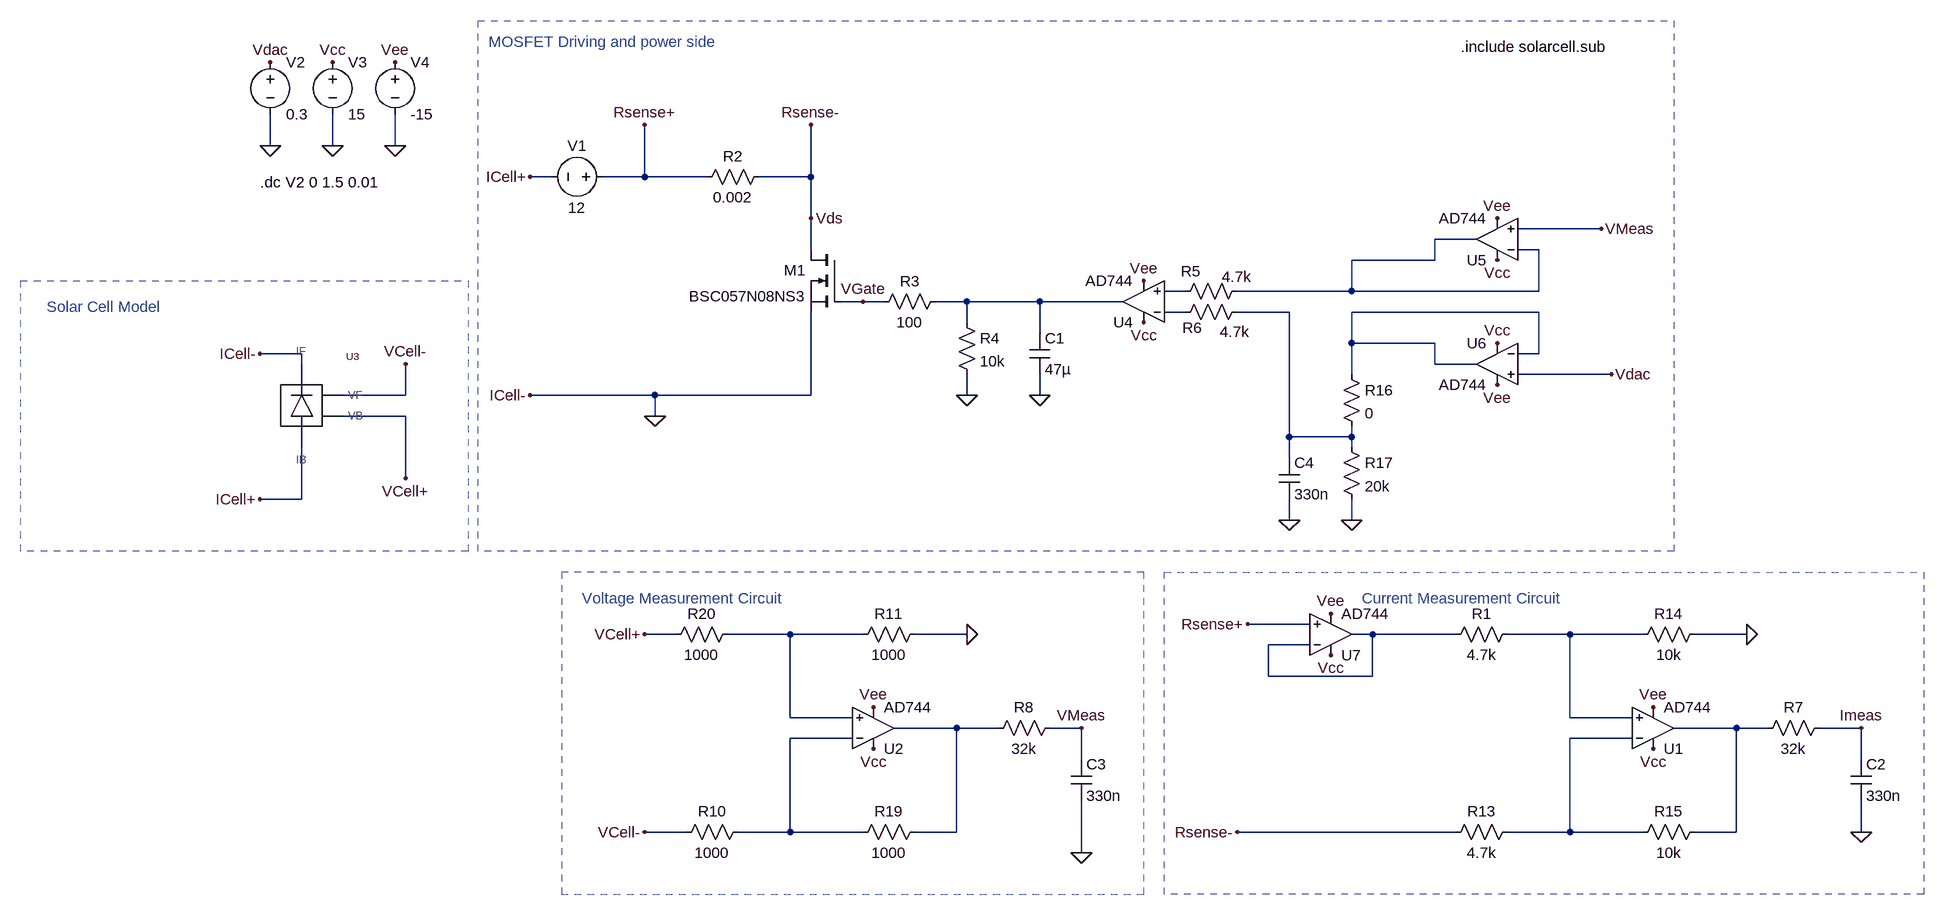
[diagram p0: schematic IVTesterFullCircuit - FVMI.asc]
IVTesterFullCircuit - FVMI.asc, the LTspice schematic file:
Version 4
SHEET 1 2216 2084
WIRE -352 528 -352 480
WIRE -256 528 -256 480
WIRE -160 528 -160 480
WIRE 80 576 48 576
WIRE 224 576 224 496
WIRE 224 576 160 576
WIRE 320 576 224 576
WIRE 480 576 480 496
WIRE 480 576 400 576
WIRE 480 640 480 576
WIRE 1696 656 1568 656
WIRE 1504 672 1440 672
WIRE 480 688 480 640
WIRE 1600 688 1568 688
WIRE 1440 704 1440 672
WIRE 1440 704 1312 704
WIRE 1056 752 1024 752
WIRE 1312 752 1312 704
WIRE 1312 752 1136 752
WIRE 1600 752 1600 688
WIRE 1600 752 1312 752
WIRE 560 768 528 768
WIRE 592 768 560 768
WIRE 720 768 672 768
WIRE 832 768 720 768
WIRE 960 768 832 768
WIRE 1056 784 1024 784
WIRE 1216 784 1136 784
WIRE 1600 784 1312 784
WIRE 720 800 720 768
WIRE 832 816 832 768
WIRE 1312 832 1312 784
WIRE 1440 832 1312 832
WIRE -304 848 -368 848
WIRE 1600 848 1600 784
WIRE 1600 848 1568 848
WIRE -304 864 -304 848
WIRE 1440 864 1440 832
WIRE 1504 864 1440 864
WIRE 1312 880 1312 832
WIRE 1712 880 1568 880
WIRE -144 912 -144 864
WIRE -144 912 -240 912
WIRE 240 912 48 912
WIRE 480 912 480 784
WIRE 480 912 240 912
WIRE 720 912 720 880
WIRE 832 912 832 880
WIRE -144 944 -240 944
WIRE 240 944 240 912
WIRE 1216 976 1216 784
WIRE 1312 976 1312 960
WIRE 1312 976 1216 976
WIRE 1312 992 1312 976
WIRE 1216 1008 1216 976
WIRE -144 1040 -144 944
WIRE -304 1072 -304 992
WIRE -304 1072 -368 1072
WIRE 1216 1104 1216 1072
WIRE 1312 1104 1312 1072
WIRE 1248 1264 1152 1264
WIRE 272 1280 224 1280
WIRE 448 1280 352 1280
WIRE 560 1280 448 1280
WIRE 720 1280 640 1280
WIRE 1344 1280 1312 1280
WIRE 1472 1280 1344 1280
WIRE 1648 1280 1552 1280
WIRE 1760 1280 1648 1280
WIRE 1920 1280 1840 1280
WIRE 1248 1296 1184 1296
WIRE 1184 1344 1184 1296
WIRE 1344 1344 1344 1280
WIRE 1344 1344 1184 1344
WIRE 448 1408 448 1280
WIRE 544 1408 448 1408
WIRE 1648 1408 1648 1280
WIRE 1744 1408 1648 1408
WIRE 704 1424 608 1424
WIRE 768 1424 704 1424
WIRE 896 1424 848 1424
WIRE 1904 1424 1808 1424
WIRE 1952 1424 1904 1424
WIRE 2096 1424 2032 1424
WIRE 544 1440 448 1440
WIRE 1744 1440 1648 1440
WIRE 896 1472 896 1424
WIRE 2096 1472 2096 1424
WIRE 288 1584 224 1584
WIRE 448 1584 448 1440
WIRE 448 1584 368 1584
WIRE 560 1584 448 1584
WIRE 704 1584 704 1424
WIRE 704 1584 640 1584
WIRE 1472 1584 1136 1584
WIRE 1648 1584 1648 1440
WIRE 1648 1584 1552 1584
WIRE 1760 1584 1648 1584
WIRE 1904 1584 1904 1424
WIRE 1904 1584 1840 1584
WIRE 2096 1584 2096 1536
WIRE 896 1616 896 1536
FLAG 720 912 0
FLAG 832 912 0
FLAG 48 576 ICell+
FLAG -352 400 Vdac
FLAG -352 528 0
FLAG -256 528 0
FLAG -160 528 0
FLAG -256 400 Vcc
FLAG -160 400 Vee
FLAG 992 800 Vcc
FLAG 1536 704 Vcc
FLAG 1536 832 Vcc
FLAG 992 736 Vee
FLAG 1536 640 Vee
FLAG 1536 896 Vee
FLAG 1920 1280 0
FLAG 2096 1584 0
FLAG 224 496 Rsense+
FLAG 480 496 Rsense-
FLAG 1136 1584 Rsense-
FLAG 1776 1456 Vcc
FLAG 1776 1392 Vee
FLAG 1312 1104 0
FLAG 1216 1104 0
FLAG 240 944 0
FLAG 1712 880 Vdac
FLAG 1696 656 VMeas
FLAG -144 864 VCell-
FLAG -144 1040 VCell+
FLAG 48 912 ICell-
FLAG 1152 1264 Rsense+
FLAG 1280 1312 Vcc
FLAG 1280 1248 Vee
FLAG 480 640 Vds
FLAG 2096 1424 Imeas
FLAG 720 1280 0
FLAG 896 1616 0
FLAG 576 1456 Vcc
FLAG 576 1392 Vee
FLAG 224 1280 VCell+
FLAG 896 1424 VMeas
FLAG 560 768 VGate
FLAG 224 1584 VCell-
FLAG -368 1072 ICell+
FLAG -368 848 ICell-
SYMBOL res 416 560 R90
WINDOW 0 0 56 VBottom 2
WINDOW 3 32 56 VTop 2
SYMATTR InstName R2
SYMATTR Value 0.002
SYMBOL voltage 176 576 R90
WINDOW 0 -32 56 VBottom 2
WINDOW 3 32 56 VTop 2
WINDOW 123 0 0 Left 0
WINDOW 39 0 0 Left 0
SYMATTR InstName V1
SYMATTR Value 12
SYMBOL res 688 752 R90
WINDOW 0 0 56 VBottom 2
WINDOW 3 32 56 VTop 2
SYMATTR InstName R3
SYMATTR Value 100
SYMBOL res 704 784 R0
SYMATTR InstName R4
SYMATTR Value 10k
SYMBOL cap 816 816 R0
SYMATTR InstName C1
SYMATTR Value 47µ
SYMBOL res 1152 736 R90
WINDOW 0 1 87 VBottom 2
WINDOW 3 -22 17 VTop 2
SYMATTR InstName R5
SYMATTR Value 4.7k
SYMBOL res 1152 768 R90
WINDOW 0 56 85 VBottom 2
WINDOW 3 31 20 VTop 2
SYMATTR InstName R6
SYMATTR Value 4.7k
SYMBOL voltage -352 384 R0
WINDOW 123 0 0 Left 0
WINDOW 39 0 0 Left 0
SYMATTR InstName V2
SYMATTR Value 0.3
SYMBOL voltage -256 384 R0
WINDOW 123 0 0 Left 0
WINDOW 39 0 0 Left 0
SYMATTR InstName V3
SYMATTR Value 15
SYMBOL voltage -160 384 R0
WINDOW 123 0 0 Left 0
WINDOW 39 0 0 Left 0
SYMATTR InstName V4
SYMATTR Value -15
SYMBOL res 2048 1408 R90
WINDOW 0 0 56 VBottom 2
WINDOW 3 32 56 VTop 2
SYMATTR InstName R7
SYMATTR Value 32k
SYMBOL cap 2080 1472 R0
SYMATTR InstName C2
SYMATTR Value 330n
SYMBOL res 1568 1568 R90
WINDOW 0 0 56 VBottom 2
WINDOW 3 32 56 VTop 2
SYMATTR InstName R13
SYMATTR Value 4.7k
SYMBOL res 1856 1264 R90
WINDOW 0 0 56 VBottom 2
WINDOW 3 32 56 VTop 2
SYMATTR InstName R14
SYMATTR Value 10k
SYMBOL res 1856 1568 R90
WINDOW 0 0 56 VBottom 2
WINDOW 3 32 56 VTop 2
SYMATTR InstName R15
SYMATTR Value 10k
SYMBOL cap 1200 1008 R0
SYMATTR InstName C4
SYMATTR Value 330n
SYMBOL res 1296 864 R0
SYMATTR InstName R16
SYMATTR Value 0
SYMBOL res 1296 976 R0
SYMATTR InstName R17
SYMATTR Value 20k
SYMBOL OpAmps\\AD744 1776 1488 M180
SYMATTR InstName U1
SYMBOL OpAmps\\AD744 992 832 R180
SYMATTR InstName U4
SYMBOL OpAmps\\AD744 1536 736 R180
SYMATTR InstName U5
SYMBOL OpAmps\\AD744 1536 800 M0
SYMATTR InstName U6
SYMBOL res 1568 1264 R90
WINDOW 0 0 56 VBottom 2
WINDOW 3 32 56 VTop 2
SYMATTR InstName R1
SYMATTR Value 4.7k
SYMBOL OpAmps\\AD744 1280 1344 M180
SYMATTR InstName U7
SYMBOL nmos 528 688 M0
SYMATTR InstName M1
SYMATTR Value BSC057N08NS3
SYMBOL res 864 1408 R90
WINDOW 0 0 56 VBottom 2
WINDOW 3 32 56 VTop 2
SYMATTR InstName R8
SYMATTR Value 32k
SYMBOL cap 880 1472 R0
SYMATTR InstName C3
SYMATTR Value 330n
SYMBOL res 384 1568 R90
WINDOW 0 0 56 VBottom 2
WINDOW 3 32 56 VTop 2
SYMATTR InstName R10
SYMATTR Value 1000
SYMBOL res 656 1264 R90
WINDOW 0 0 56 VBottom 2
WINDOW 3 32 56 VTop 2
SYMATTR InstName R11
SYMATTR Value 1000
SYMBOL res 656 1568 R90
WINDOW 0 0 56 VBottom 2
WINDOW 3 32 56 VTop 2
SYMATTR InstName R19
SYMATTR Value 1000
SYMBOL OpAmps\\AD744 576 1488 M180
SYMATTR InstName U2
SYMBOL res 368 1264 R90
WINDOW 0 0 56 VBottom 2
WINDOW 3 32 56 VTop 2
SYMATTR InstName R20
SYMATTR Value 1000
SYMBOL solarcell -304 880 R0
SYMATTR InstName U3
TEXT -368 584 Left 2 !.dc V2 0 1.5 0.01
TEXT -696 776 Left 2 ;Solar Cell Model
TEXT 1328 1224 Left 2 ;Current Measurement Circuit
TEXT -16 368 Left 2 ;MOSFET Driving and power side
TEXT 128 1224 Left 2 ;Voltage Measurement Circuit
TEXT 1480 376 Left 2 !.include solarcell.sub
RECTANGLE Normal 2192 1680 1024 1184 2
RECTANGLE Normal -32 336 1808 1152 2
RECTANGLE Normal -48 1152 -736 736 2
RECTANGLE Normal 96 1680 992 1184 2

The netlist it stands for:
* IVTesterFullCircuit - FVMI.asc
R2 Vds Rsense+ 0.002
V1 Rsense+ ICell+ 12
R3 N003 VGate 100
R4 N003 0 10k
C1 N003 0 47µ
R5 N001 N002 4.7k
R6 N005 N004 4.7k
V2 Vdac 0 0.3
V3 Vcc 0 15
V4 Vee 0 -15
R7 Imeas N011 32k
C2 Imeas 0 330n
R13 N013 Vds 4.7k
R14 0 N009 10k
R15 N011 N013 10k
C4 N005 0 330n
R16 N006 N005 0
R17 N005 0 20k
XU1 N009 N013 Vcc Vee N011 AD744  ; pins In+ In- V+ V- OUT
XU4 N002 N004 Vcc Vee N003 AD744  ; pins In+ In- V+ V- OUT
XU5 VMeas N001 Vcc Vee N001 AD744  ; pins In+ In- V+ V- OUT
XU6 Vdac N006 Vcc Vee N006 AD744  ; pins In+ In- V+ V- OUT
R1 N009 N008 4.7k
XU7 Rsense+ N008 Vcc Vee N008 AD744  ; pins In+ In- V+ V- OUT
M1 Vds VGate 0 0 BSC057N08NS3
R8 VMeas N010 32k
C3 VMeas 0 330n
R10 N012 VCell- 1000
R11 0 N007 1000
R19 N010 N012 1000
XU2 N007 N012 Vcc Vee N010 AD744  ; pins In+ In- V+ V- OUT
R20 N007 VCell+ 1000
XU3 0 ICell+ VCell- VCell+ solarcell  ; pins IF IB VF VB
.model NMOS NMOS
.model PMOS PMOS
.lib standard.mos
.dc V2 0 1.5 0.01
* Solar Cell Model
* Current Measurement Circuit
* MOSFET Driving and power side
* Voltage Measurement Circuit
.include solarcell.sub
.backanno
.end